# Altium schematic sheet sch_AGV_MCU.SchDoc
size A; SheetNumber: 4; SheetTotal: 6
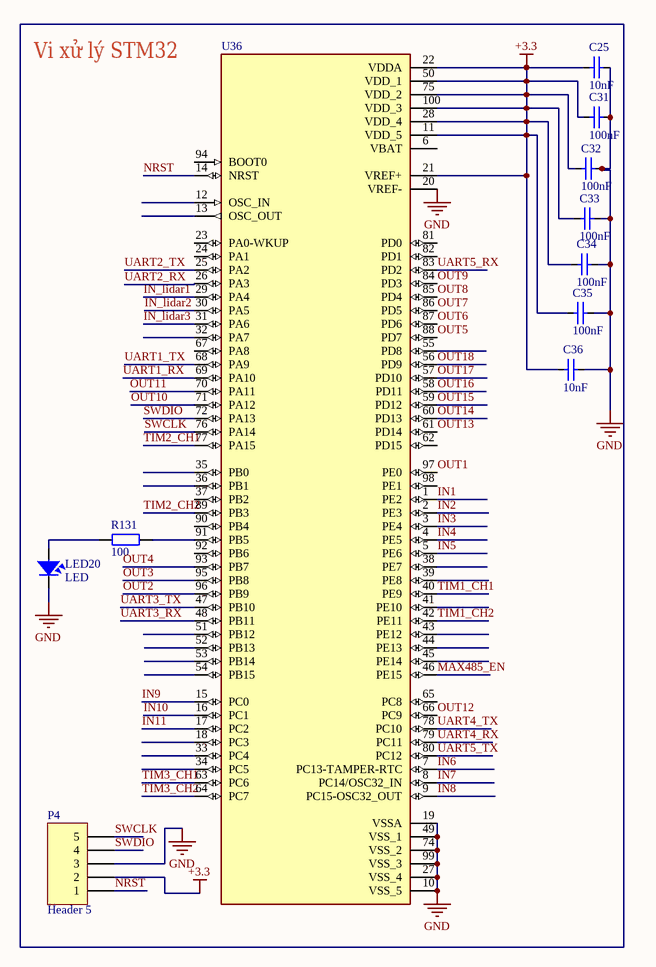
[diagram p0: sch_AGV_MCU.SchDoc]

## Parts
C25  10nF  [CAP_0805]
C31  100nF  [CAP_0805]
C32  100nF  [CAP_0805]
C33  100nF  [CAP_0805]
C34  100nF  [CAP_0805]
C35  100nF  [CAP_0805]
C36  10nF  [CAP_0805]
LED20  LED  [LED_BLUE_SMD_0805]
P4  Header 5  [HDR5]
R131  100  [RES_SMD_0805]
U36  (no value)  [QFP50P1600X1600X160-100N]

## Nets
+3.3: C25.1 C31.1 C32.1 C33.1 C34.1 C35.1 C36.1 P4.2 U36.11(VDD_5) U36.21(VREF+) U36.22(VDDA) U36.28(VDD_4) U36.50(VDD_1) U36.75(VDD_2) U36.100(VDD_3)
GND: C25.2 C31.2 C32.2 C33.2 C34.2 C35.2 C36.2 LED20.2 P4.3 U36.10(VSS_5) U36.19(VSSA) U36.20(VREF-) U36.27(VSS_4) U36.49(VSS_1) U36.74(VSS_2) U36.99(VSS_3)
IN1: U36.1(PE2)
IN2: U36.2(PE3)
IN3: U36.3(PE4)
IN4: U36.4(PE5)
IN5: U36.5(PE6)
IN6: U36.7(PC13-TAMPER-RTC)
IN7: U36.8(PC14/OSC32_IN)
IN8: U36.9(PC15-OSC32_OUT)
IN9: U36.15(PC0)
IN10: U36.16(PC1)
IN11: U36.17(PC2)
IN_lidar1: U36.29(PA4)
IN_lidar2: U36.30(PA5)
IN_lidar3: U36.31(PA6)
MAX485_EN: U36.46(PE15)
NRST: P4.1 U36.14(NRST)
OUT1: U36.97(PE0)
OUT2: U36.96(PB9)
OUT3: U36.95(PB8)
OUT4: U36.93(PB7)
OUT5: U36.88(PD7)
OUT6: U36.87(PD6)
OUT7: U36.86(PD5)
OUT8: U36.85(PD4)
OUT9: U36.84(PD3)
OUT10: U36.71(PA12)
OUT11: U36.70(PA11)
OUT12: U36.66(PC9)
OUT13: U36.61(PD14)
OUT14: U36.60(PD13)
OUT15: U36.59(PD12)
OUT16: U36.58(PD11)
OUT17: U36.57(PD10)
OUT18: U36.56(PD9)
SWCLK: P4.5 U36.76(PA14)
SWDIO: P4.4 U36.72(PA13)
TIM1_CH1: U36.40(PE9)
TIM1_CH2: U36.42(PE11)
TIM2_CH1: U36.77(PA15)
TIM2_CH2: U36.89(PB3)
TIM3_CH1: U36.63(PC6)
TIM3_CH2: U36.64(PC7)
UART1_RX: U36.69(PA10)
UART1_TX: U36.68(PA9)
UART2_RX: U36.26(PA3)
UART2_TX: U36.25(PA2)
UART3_RX: U36.48(PB11)
UART3_TX: U36.47(PB10)
UART4_RX: U36.79(PC11)
UART4_TX: U36.78(PC10)
UART5_RX: U36.83(PD2)
UART5_TX: U36.80(PC12)
NetLED20_1: LED20.1 R131.1
NetR131_2: R131.2 U36.91(PB5)

Not connected (* = marked no-connect by the designer): U36 6(VBAT) 12(OSC_IN) 13(OSC_OUT) 18(PC3) 23(PA0-WKUP) 24(PA1) 32(PA7) 33(PC4) 34(PC5) 35(PB0) 36(PB1) 37(PB2) 38(PE7) 39(PE8) 41(PE10) 43(PE12) 44(PE13) 45(PE14) 51(PB12) 52(PB13) 53(PB14) 54(PB15) 55(PD8) 62(PD15) 65(PC8) 67(PA8) 81(PD0) 82(PD1) 90(PB4) 92(PB6) 94(BOOT0) 98(PE1)

## Notes on the sheet
- (near U36) Vi xử lý STM32

## Library data of the parts
C25 C31-C36 = CapSMD: Capacitor; Value: 33p; Published: 8-Jun-2000; LatestRevisionDate: 17-Jul-2002; LatestRevisionNote: Re-released for DXP Platform.; PackageReference: RAD-0.3; Publisher: Altium Limited
LED20 = LED: LED Single colour Green and Red; Value: LED 3 ly Single Colour
P4 = Header 5: Header, 5-Pin; LatestRevisionDate: 17-Jul-2002; LatestRevisionNote: Re-released for DXP Platform.; Publisher: Altium Limited
R131 = Res: Resistor; Manufacturer: Generic Components; Class: Passive; Published: 08/06/2000; Publisher: Altium Hobart Technology Centre
U36 = STM32F103VET6: ARMÂ® CortexÂ®-M3 STM32F1 Microcontroller IC 32-Bit 72MHz 512KB (512K x 8) FLASH 100-LQFP (14x14); MF: STMicroelectronics; SnapEDA_Link: https://www.snapeda.com/parts/STM32F103VET6/STMicroelectronics/view-part/?ref=snap; Package: LQFP-100 STMicroelectronics; Value: *; MP: STM32F103VET6; Check_prices: https://www.snapeda.com/parts/STM32F103VET6/STMicroelectronics/view-part/?ref=eda